# EAGLE design DAC_I2C (EAGLE 7.1.0)
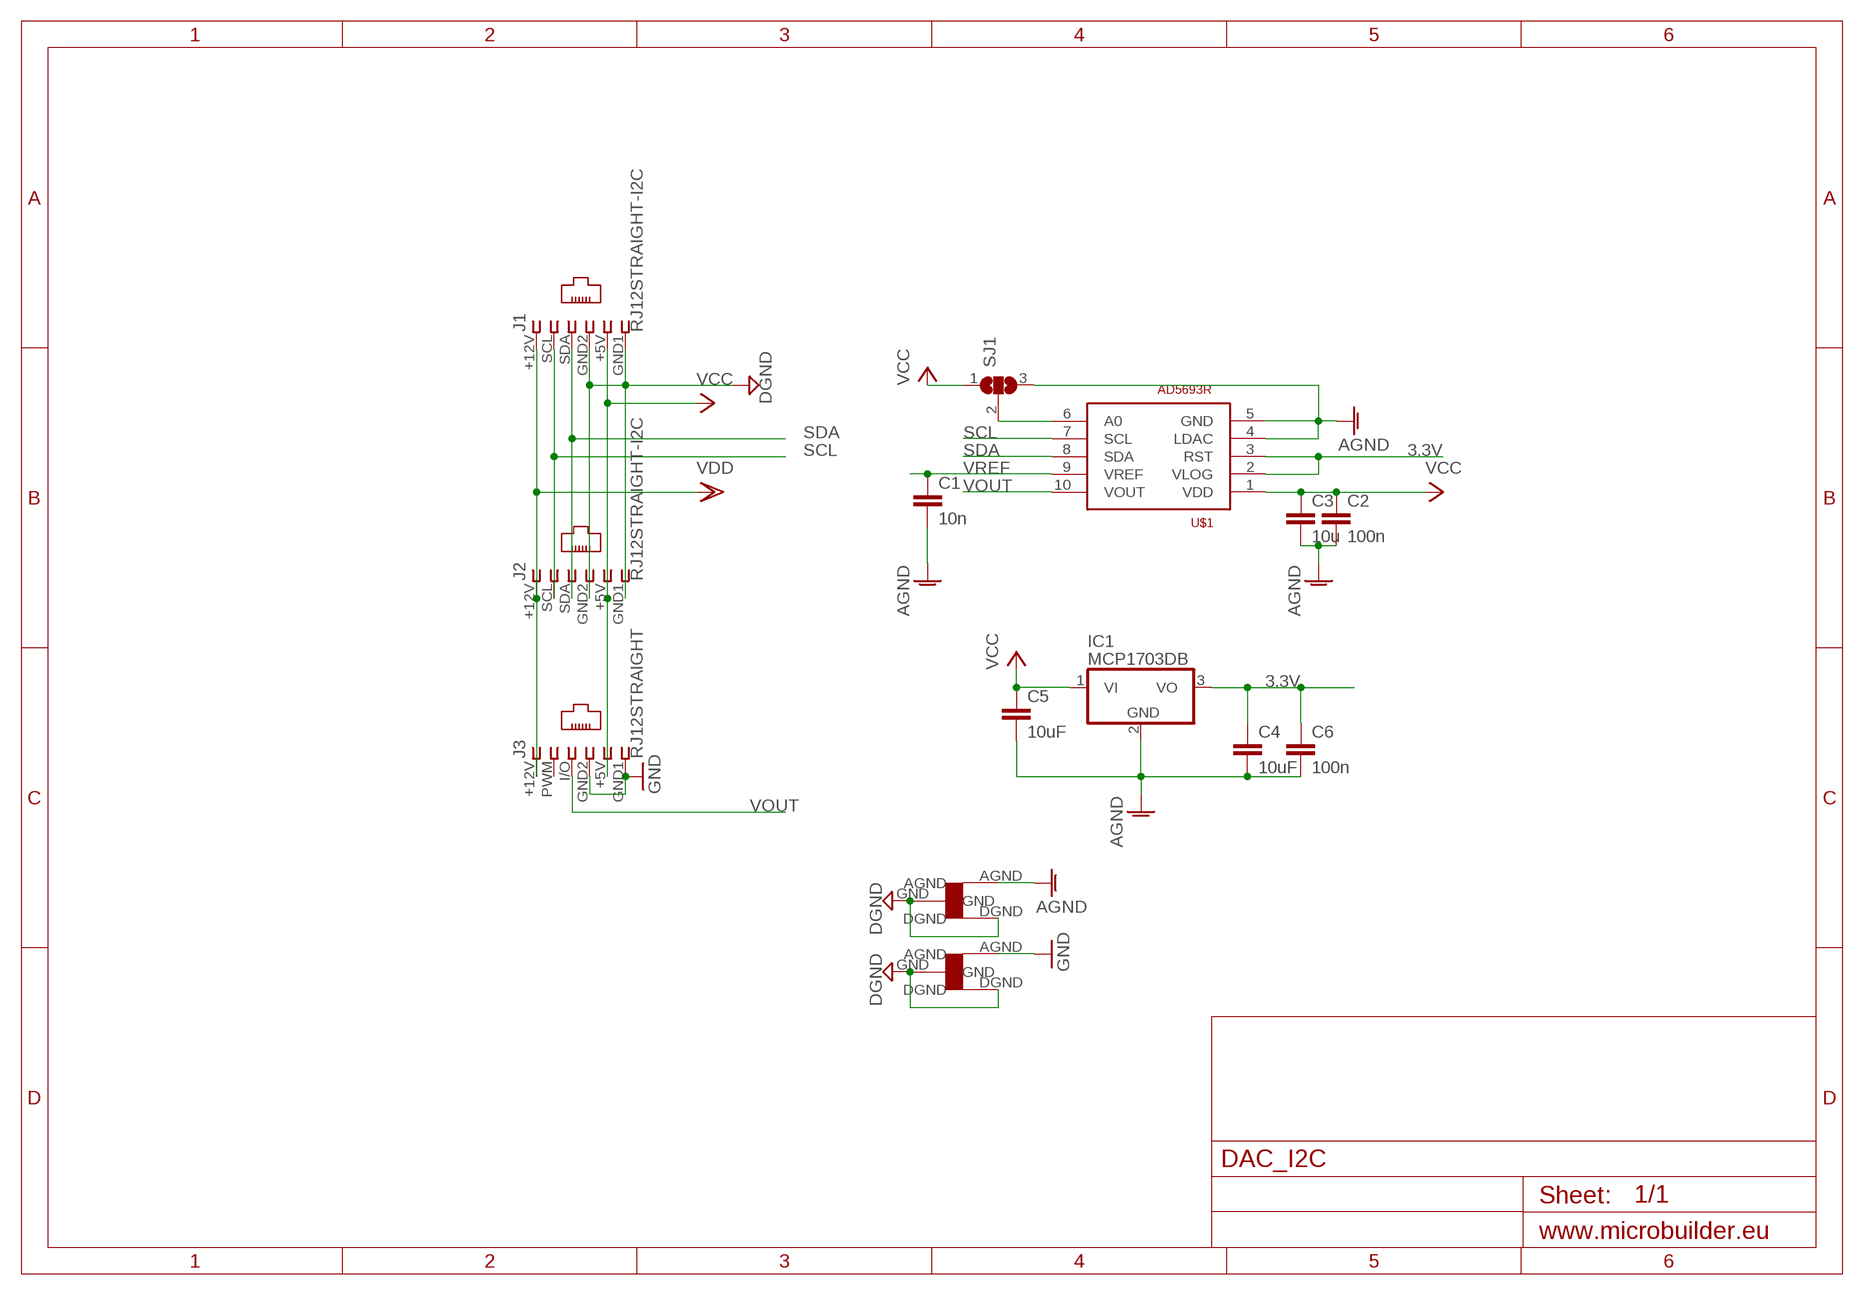
[diagram p0: schematic, sheet 1]

## Parts
C1  10n  C-EUC1206  [C1206]
C2  100n  C-EUC1206  [C1206]
C3  10u  C-EUC1206  [C1206]
C4  10uF  C-EUC1206  [C1206]
C5  10uF  C-EUC1206  [C1206]
C6  100n  C-EUC1206  [C1206]
IC1  MCP1703DB  [SOT223]
J1  RJ12STRAIGHT-I2C  [RJ12-STRAIGHT-I2C]
J2  RJ12STRAIGHT-I2C  [RJ12-STRAIGHT-I2C]
J3  RJ12STRAIGHT  [RJ12-STRAIGHT]
SJ1  SJ2W  [SJ_2]
U$1  AD5693R  [MSOP10]
U$2  STARGND  [STAR]
U$5  STARGND  [STAR]

## Nets
3.3V [power]: C4.1 C6.1 IC1.3(VO) U$1.2(VLOG) U$1.3(RST)
AGND: C1.2 C2.2 C3.2 C4.2 C5.2 C6.2 IC1.2(GND) SJ1.3 U$1.4(LDAC) U$1.5(GND) U$5.AGND
DGND: J1.GND1 J1.GND2 J2.GND1 J2.GND2 U$2.DGND U$2.GND U$5.DGND U$5.GND
GND: J3.GND1 J3.GND2 U$2.AGND
N$1: SJ1.2 U$1.6(A0)
SCL: J1.SCL J2.SCL U$1.7(SCL)
SDA: J1.SDA J2.SDA U$1.8(SDA)
VCC: C2.1 C3.1 C5.1 IC1.1(VI) J1.+5V J2.+5V J3.+5V SJ1.1 U$1.1(VDD)
VDD: J1.+12V J2.+12V J3.+12V
VOUT: J3.I/O U$1.10(VOUT)
VREF: C1.1 U$1.9(VREF)
Unconnected: J3.PWM

## Library data of the parts
C1-C6 = rcl:C-EU: CAPACITOR, European symbol
IC1 = linear:MCP1703: 250 mA, 16V, Low Quiescent Current LDO Regulator Source: http://ww1.microchip.com/downloads/en/DeviceDoc/22049b.pdf
J1-J3 = lpatiny:RJ12: CORCOM Modular RJ Jacks No Shield Source: www.tycoelectronics.com .. ENG_DS_1654001_1099_RJ_L_0507.pdf
SJ1 = jumper:SJ2W: SMD solder JUMPER
U$1 = lpatiny:AD5693R: The AD5693R/AD5692R/AD5691R/AD5693, members of the nanoDAC+® family, are low power, single-channel, 16-/14-/ 12-bit buffered voltage output DACs. The devices, except the AD5693, include an enabled by default internal 2.5 V reference, offering 2 ppm/°C drift. The output span can be programmed to be 0 V to V REF or 0 V to 2 × V REF . All devices operate from a single 2.7 V to 5.5 V supply and are guaranteed monotonic by design. The devices are available in a 2.00 mm × 2.00 mm, 8-lead LFCSP or a 10-lead MSOP.
U$2 U$5 = lpatiny:STARGND

## Net classes
0 default: width 0.305 mm, drill 0.254 mm
1 power: width 0.305 mm, drill 0.254 mm
2 GND: width 0.127 mm, clearance 0.762 mm

## Board
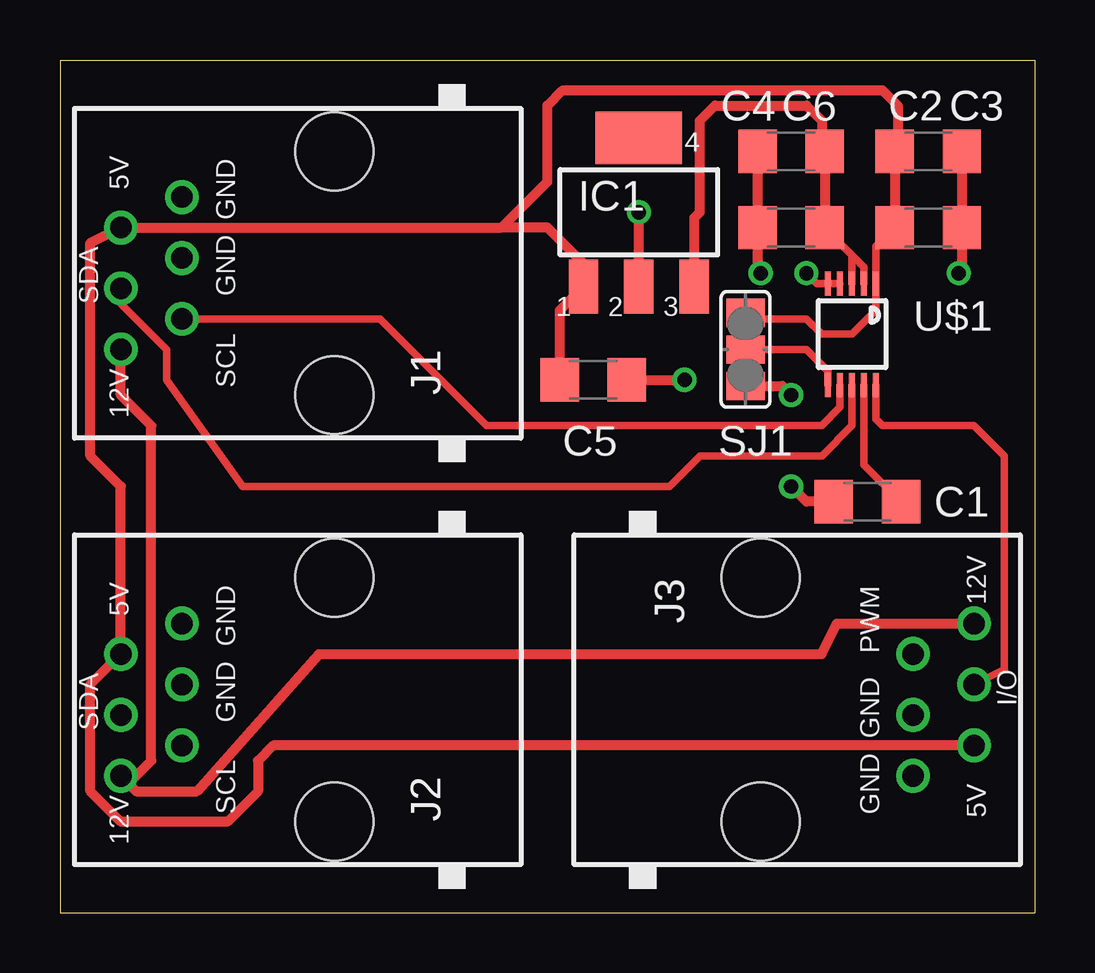
[diagram p1: board, top side]
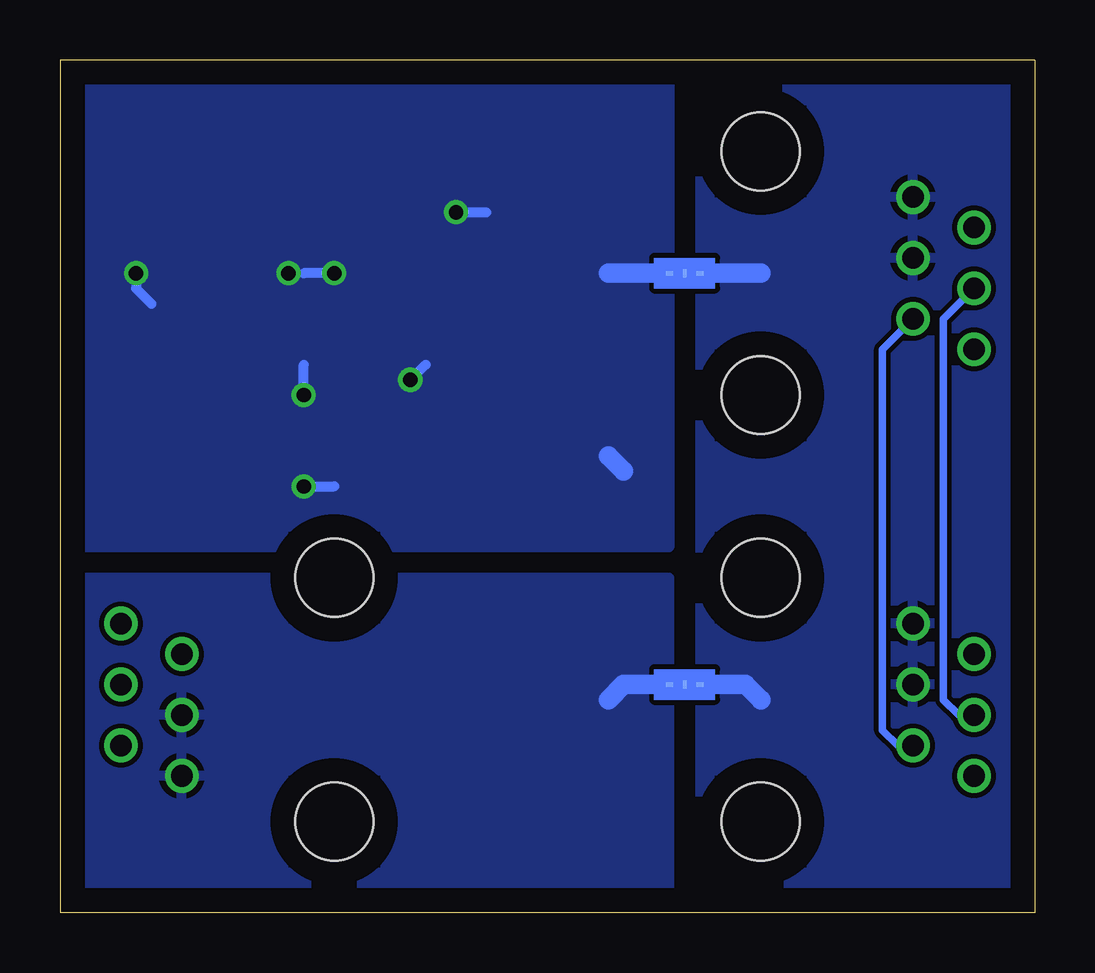
[diagram p2: board, bottom side, seen from below]

Size 40.64 x 35.56 mm. Coordinates in mm from the lower left corner, seen from the top.
Outline: 0,35.55 0,0 40.64,0 40.64,35.56 0,35.56
Copper layers (1*16): Top 0.035mm / dielectric 1.5mm / Bottom 0.035mm
Design rules "default": minimum track width 10mil, minimum drill 24mil, track to track 8mil, track to pad 8mil, pad to pad 8mil, via to via 8mil, smd to smd 8mil, copper to edge 40mil, drill to drill 8mil, minimum pad ring 10mil, minimum via ring 8mil, stop-mask expansion 4mil, vias tented up to drill 0mil, thermal gap 10mil

### Footprints (pad centres in the part's own frame; a part is rotated, then mirrored left to right if it is on the bottom)
C1206 = smd 1.6 x 1.8: 1 -1.4,0; 2 1.4,0
SOT223 = smd 1.219 x 2.235: 1 -2.311,-3.099; 2 0,-3.099; 3 2.311,-3.099 | smd 3.6 x 2.2: 4 0,3.099
RJ12-STRAIGHT-I2C = drill 0.9 pad 1.4: +5V 1.905,8.89; +12V -3.175,8.89; GND1 3.175,6.35; GND2 0.635,6.35; SCL -1.905,6.35; SDA -0.635,8.89 | hole 3.251: -5.08,0; 5.08,0
RJ12-STRAIGHT = drill 0.9 pad 1.4: +5V 1.905,8.89; +12V -3.175,8.89; GND1 3.175,6.35; GND2 0.635,6.35; I/O -0.635,8.89; PWM -1.905,6.35 | hole 3.251: -5.08,0; 5.08,0
SJ_2 = smd 1.168 x 1.6: 1 -1.524,0; 2 0,0; 3 1.524,0
MSOP10 = smd 0.25 x 1: 1 -1,-2.113; 2 -0.5,-2.113; 3 0,-2.113; 4 0.5,-2.113; 5 1,-2.113; 6 1,2.113; 7 0.5,2.113; 8 0,2.113; 9 -0.5,2.113; 10 -1,2.113
STAR = smd 0.152 x 0.305: AGND 0.635,-0.635; DGND 0.635,0.635 | smd 0.305 x 0.152: GND 0.635,0

### Placement (x,y rotation side)
C1  33.66,17.14 180 top
C2  36.2,28.57 0 top
C3  36.2,31.75 0 top
C4  30.48,31.75 180 top
C5  22.23,22.23 0 top
C6  30.48,28.57 180 top
IC1  24.13,29.21 0 top
J1  11.43,26.67 90 top
J2  11.43,8.89 90 top
J3  29.21,8.89 270 top
SJ1  28.57,23.5 270 top
U$1  33.02,24.13 180 top
U$2  14.61,10.16 270 bottom
U$5  14.61,27.3 270 bottom

### Tracks (layer width: path | path; a pad name or v marks a point on that pad's centre or on a via)
3.3V
  Top 0.305: U$1.3 33.02,27.43 | 33.02,27.43 C6.1 | U$1.2 33.52,26.93 33.02,27.43
  Top 0.406: IC1.3 26.44,28.98 26.67,29.21 26.67,33.02 27.3,33.66 31.11,33.66 31.75,33.02 31.75,31.88 C4.1 C6.1
AGND  (via drill 0.6)
  Top 0.305: U$1.4 U$1.5 31.54,26.24 v31.11,26.67
  Top 0.406: IC1.2 v24.13,29.21 | C4.2 C6.2 29.08,26.8 v29.21,26.67 | C5.2 v26.04,22.23 | SJ1.3 30.1,21.97 v30.48,21.59 | C1.2 31.11,17.14 v30.48,17.78 | C3.2 C2.2 37.59,26.8 v37.47,26.67
  Bottom 0.305: v31.11,26.67 30.48,26.67
  Bottom 0.406: v24.13,29.21 22.86,29.21 | v29.21,26.67 30.48,26.67 | v26.04,22.23 25.4,22.86 | v30.48,21.59 30.48,22.86 | v30.48,17.78 29.21,17.78 | v37.47,26.67 37.47,26.04 36.83,25.4
  Bottom 0.813: 17.14,18.41 17.78,19.05 | U$5.AGND 17.78,26.67
  pour Bottom: 40.64,35.56 15.24,35.56 15.24,15.24 40.64,15.24
DGND
  Bottom 0.813: U$2.GND U$2.DGND 12.06,9.53 11.43,8.89 | U$5.GND U$5.DGND 11.43,26.67
  pour Bottom: 0,35.56 13.97,35.56 13.97,0 0,0
GND
  Bottom 0.813: U$2.AGND 17.14,9.53 17.78,8.89
  pour Bottom: 15.24,13.97 40.64,13.97 40.64,0 15.24,0
N$1
  Top 0.305: U$1.6 32.02,22.59 31.11,23.5 SJ1.2
SCL
  Top 0.305: U$1.7 32.52,21.09 31.75,20.32 17.78,20.32 13.34,24.77 J1.SCL
  Bottom 0.305: J2.SCL 5.71,6.99 6.35,7.62 6.35,23.5 J1.SCL
SDA
  Top 0.305: U$1.8 33.02,20.32 31.75,19.05 26.67,19.05 25.4,17.78 7.62,17.78 4.45,22.23 4.45,23.5 2.54,25.4 J1.SDA
  Bottom 0.305: J2.SDA 3.17,8.26 3.81,8.89 3.81,24.77 J1.SDA
VCC
  Top 0.305: C2.1 34.02,27.8 U$1.1 34.02,25.13 33.02,24.13 31.75,24.13 31.11,24.77 28.83,24.77 SJ1.1
  Top 0.406: C2.1 C3.1 34.92,31.88 34.92,33.66 34.29,34.29 20.95,34.29 20.32,33.66 20.32,30.48 18.41,28.57 | C5.1 20.82,25.12 IC1.1 21.82,27.08 20.32,28.57 18.41,28.57 | J3.+5V 8.89,6.99 8.26,6.35 8.26,5.08 6.99,3.81 2.54,3.81 1.27,5.08 1.27,9.53 J2.+5V 2.54,17.78 1.27,19.05 1.27,27.94 J1.+5V 18.41,28.57
VDD
  Top 0.406: J1.+12V 2.54,21.59 3.81,20.32 3.81,6.35 3.17,5.71 J2.+12V 3.17,5.08 5.71,5.08 10.79,10.79 31.75,10.79 32.38,12.06 J3.+12V
VOUT
  Top 0.305: U$1.10 34.02,20.59 34.29,20.32 38.1,20.32 39.37,19.05 39.37,10.16 J3.I/O
VREF
  Top 0.305: U$1.9 33.52,18.68 C1.1